# Altium schematic sheet [01] - COVER PAGE.SchDoc
size A3; DocumentNumber: 1; SheetNumber: 1; SheetTotal: 9
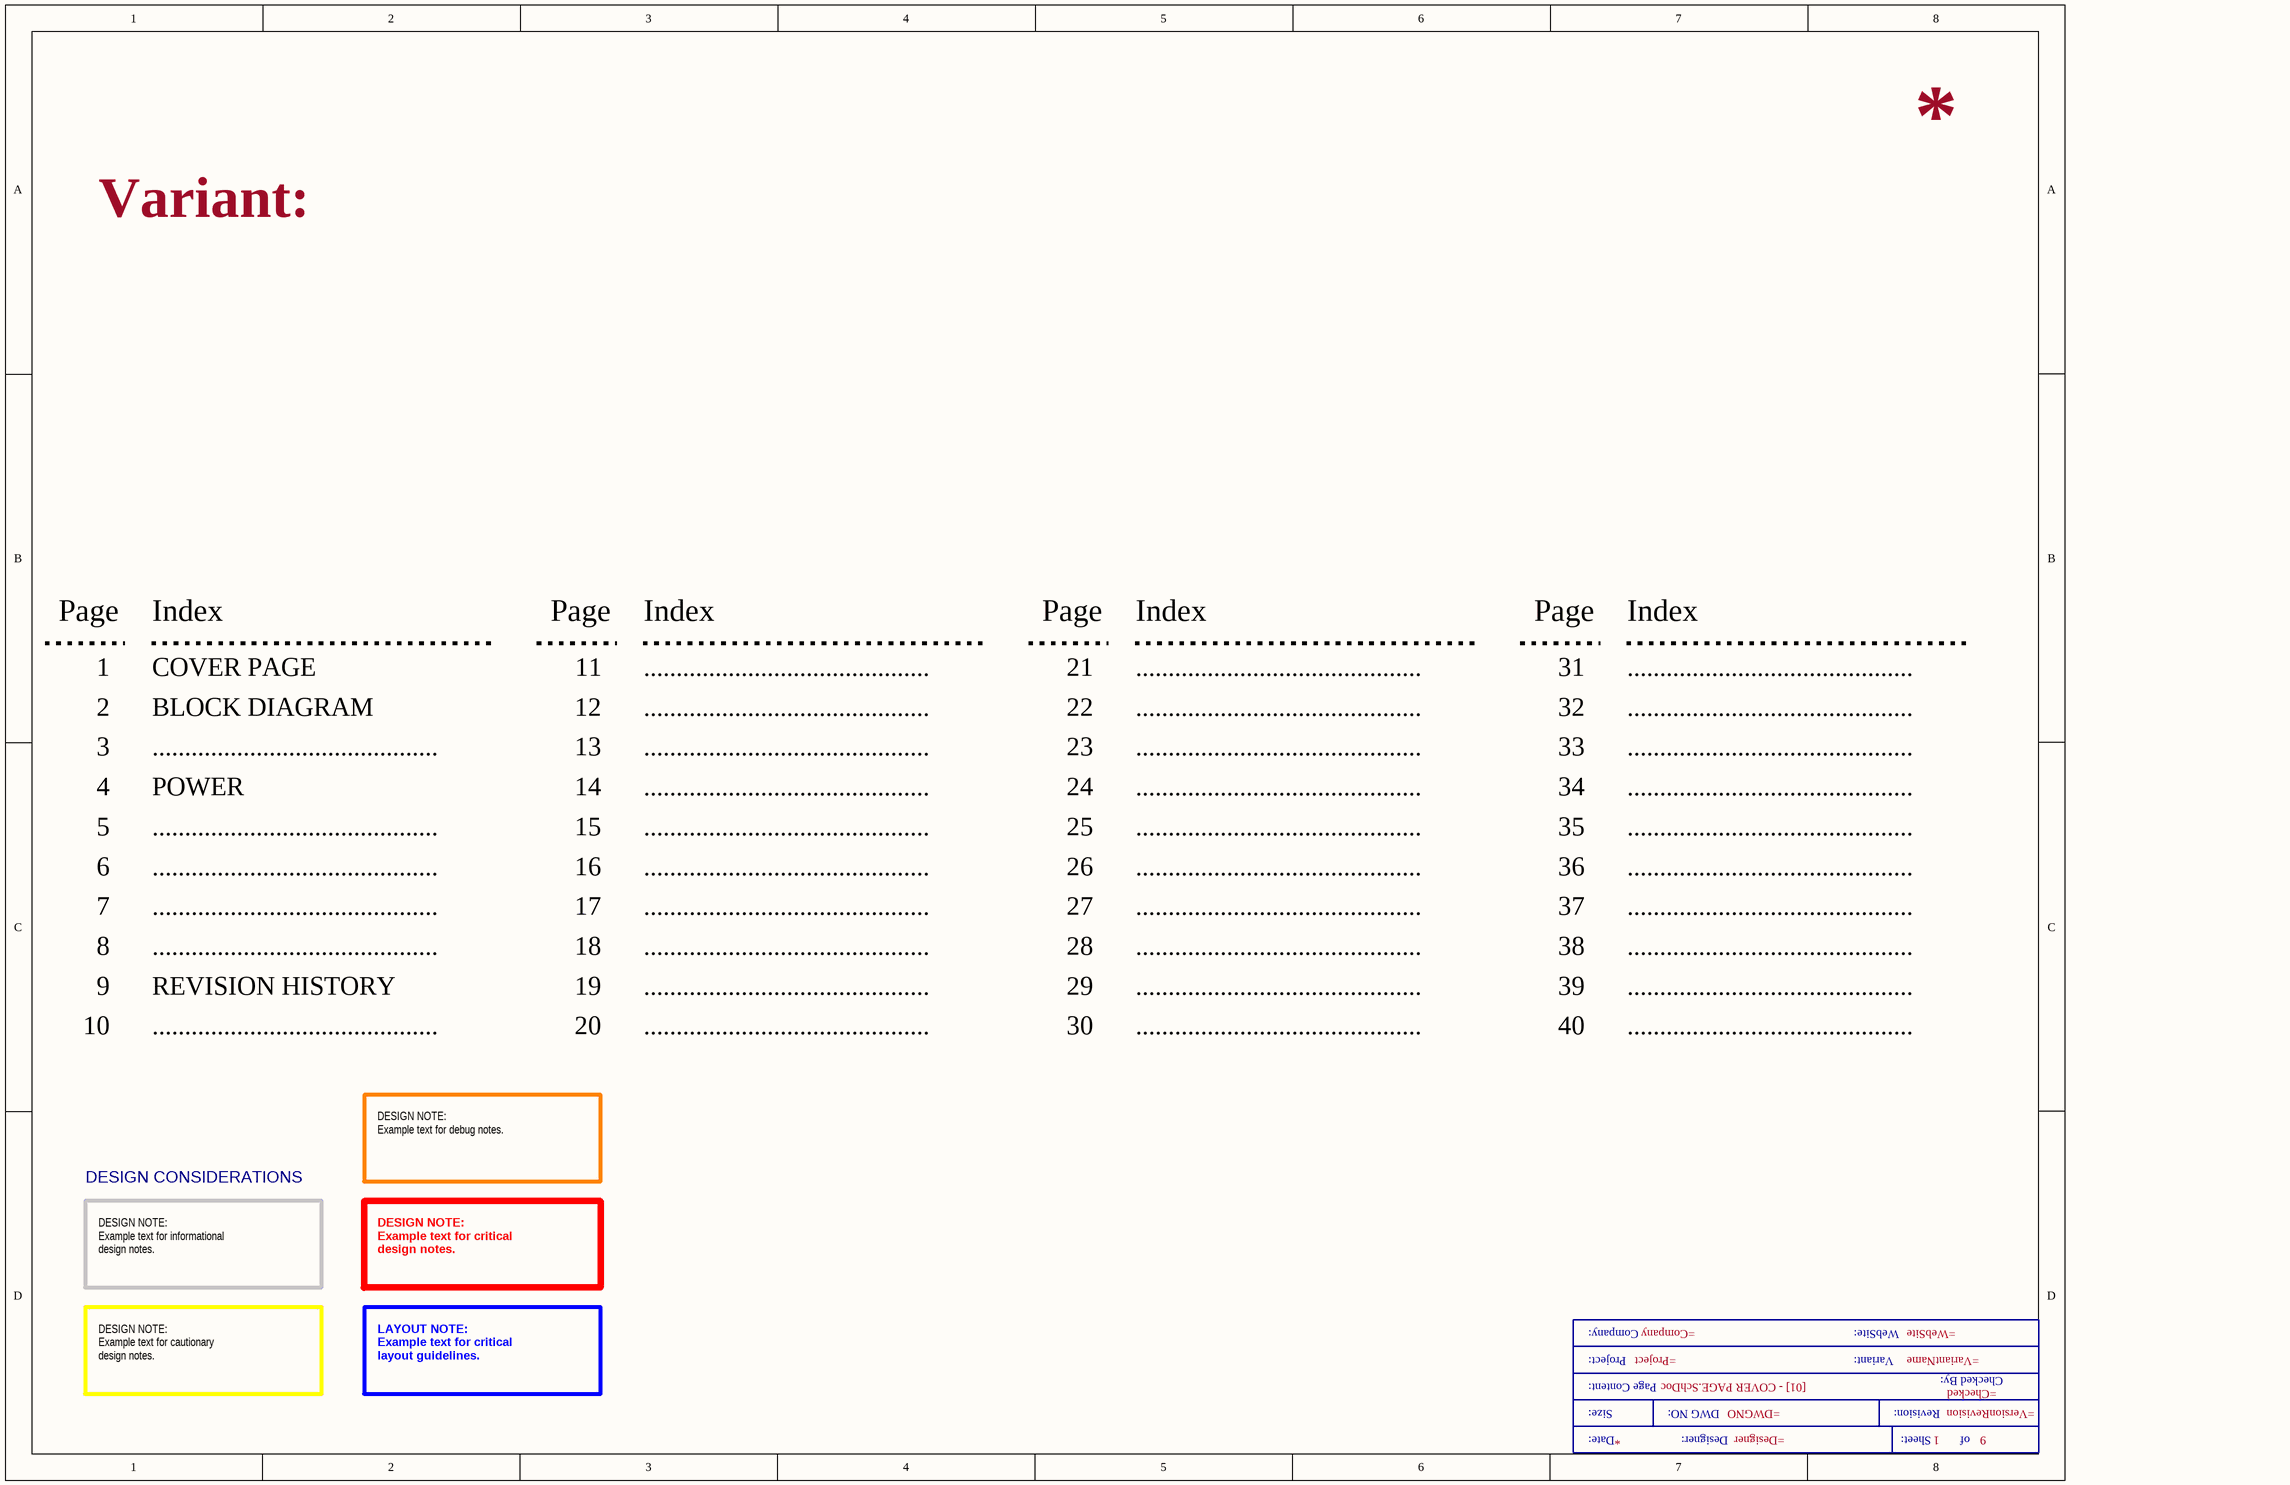
[diagram p0: [01] - COVER PAGE.SchDoc]

## Parts
*  Title Block  (value not drawn)  (graphical)

## Notes on the sheet
- Variant:
- Page
- Index
- 1
- COVER PAGE
- 11
- ............................................
- 21
- 31
- 2
- 3
- BLOCK DIAGRAM
- 12
- 13
- 22
- 23
- 32
- 33
- 4
- 5
- POWER
- 14
- 15
- 24
- 25
- 34
- 35
- 6
- 16
- 26
- 36
- 7
- 8
- 17
- 18
- 27
- 28
- 37
- 38
- 9
- 10
- REVISION HISTORY
- 19
- 20
- 29
- 30
- 39
- 40
- DESIGN NOTE:
  Example text for debug notes.
- DESIGN CONSIDERATIONS
- DESIGN NOTE:
  Example text for informational
  design notes.
- DESIGN NOTE:
  Example text for critical
  design notes.
- DESIGN NOTE:
  Example text for cautionary
  design notes.
- LAYOUT NOTE:
  Example text for critical
  layout guidelines.
- (in symbol Title Block) Company:; WebSite:; Project:; Variant:; Checked By:; Page Content:; Size:; DWG NO:; Revision:; Date:; Designer:; Sheet:; of